# Altium schematic sheet CAMERA_DVP_FPC24_OV7670.SchDoc
size A3; SheetNumber: 6; SheetTotal: 7
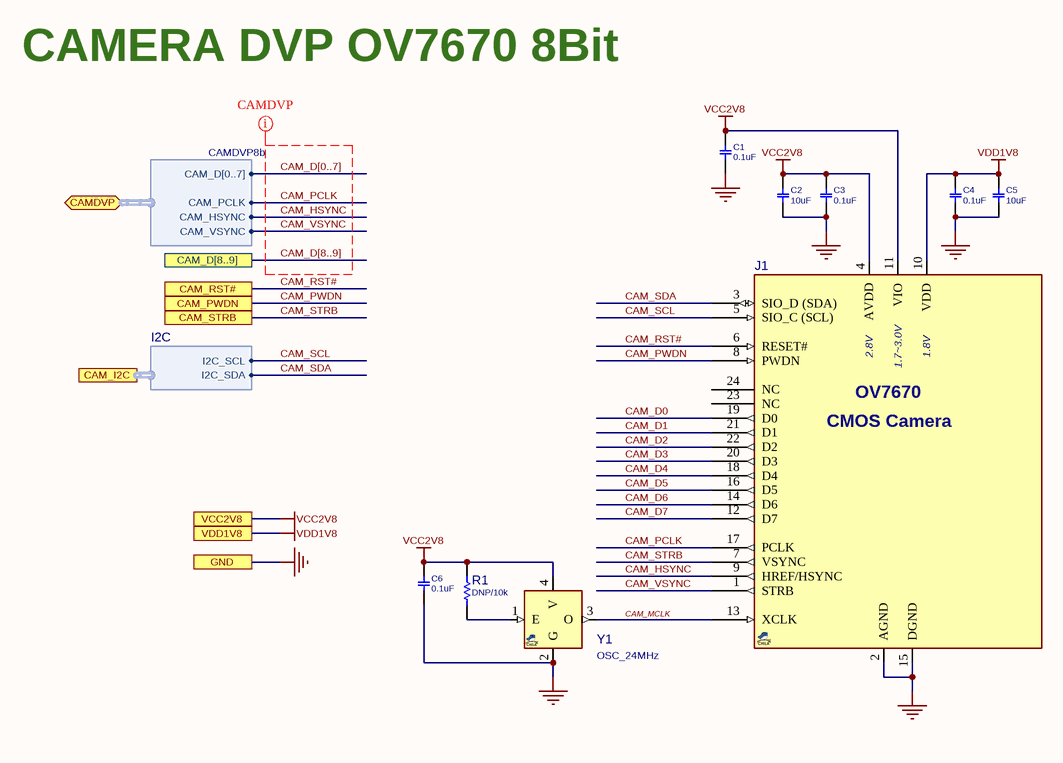
[diagram p0: CAMERA_DVP_FPC24_OV7670.SchDoc]

## Parts
C1  0.1uF  [C0402]
C2  10uF  [C0402]
C3  0.1uF  [C0402]
C4  0.1uF  [C0402]
C5  10uF  [C0402]
C6  0.1uF  [C0402]
J1  OV7670  [FPC50_24]  (value not drawn)
R1  DNP/10k  [R0402]
Y1  OSC_24MHz  [XTL_4_3225GEN]

## Ports
CAM_D[8..9], CAM_I2C (harness I2C), CAM_PWDN, CAM_RST#, CAM_STRB, CAMDVP (bidir, harness CAMDVP8b), GND, VCC2V8, VDD1V8

## Harnesses
CAMDVP8b: CAM_D[0..7], CAM_PCLK, CAM_HSYNC, CAM_VSYNC
I2C: I2C_SCL, I2C_SDA

## Nets
GND: C1.2 C2.2 C3.2 C4.2 C5.2 C6.2 J1.2(AGND) J1.15(DGND) Y1.2(G) ; port GND
VCC2V8: C1.1 C2.1 C3.1 C6.1 J1.4(AVDD) J1.11(VIO) R1.1 Y1.4(V) ; port VCC2V8
VDD1V8: C4.1 C5.1 J1.10(VDD) ; port VDD1V8
CAM_D0: J1.19(D0)
CAM_D1: J1.21(D1)
CAM_D2: J1.22(D2)
CAM_D3: J1.20(D3)
CAM_D4: J1.18(D4)
CAM_D5: J1.16(D5)
CAM_D6: J1.14(D6)
CAM_D7: J1.12(D7)
CAM_HSYNC: J1.9(HREF/HSYNC) ; port CAMDVP.CAM_HSYNC
CAM_MCLK: J1.13(XCLK) Y1.3(O)
CAM_PCLK: J1.17(PCLK) ; port CAMDVP.CAM_PCLK
CAM_PWDN: J1.8(PWDN) ; port CAM_PWDN
CAM_RST#: J1.6(RESET#) ; port CAM_RST#
CAM_SCL: J1.5(SIO_C_(SCL)) ; port CAM_I2C.I2C_SCL
CAM_SDA: J1.3(SIO_D_(SDA)) ; port CAM_I2C.I2C_SDA
CAM_STRB: J1.7(VSYNC) ; port CAM_STRB
CAM_VSYNC: J1.1(STRB) ; port CAMDVP.CAM_VSYNC
NetR1_2: R1.2 Y1.1(E)

Not connected (* = marked no-connect by the designer): J1 23(NC) 24(NC)

## Buses and harness runs
bus CAM_D[0..7]
bus CAM_D[8..9] = port CAM_D[8..9]

## Layout directives
net class CAMDVP: CAM_D[0..7], CAM_D[8..9], CAM_HSYNC, CAM_PCLK, CAM_VSYNC

## Notes on the sheet
- CAMERA DVP OV7670 8Bit
- (in symbol OV7670_FPC24) 2.8V; 1.7~3.0V; 1.8V; CMOS Camera

## Library data of the parts
C1-C6 = CAP_SMD_MLCC_100n50TDK: CAP, MLCC; PARAM2: 50V; PARAM: -; MANF_P#: -; MANF: -; ASSEMBLY: ASSEMBLY; PRICE: -
  C1 C3 C4 C6: VALUE: 0.1uF
  C2 C5: VALUE: 10uF
J1 = OV7670_FPC24: Camera Module, Color CMOS VGA (640 x 480)  DVP FPC24; PARAM2: 2.8v; Value: OV7670; MANF_P#: OV7670; PARAM: VGA (640 x 480)
R1 = RES_SMD_1K_0402YK: RESISTOR, SMD, THICK FILM, YAGEO; MANF_P#: RC0402FR-071KL; PARAM: 0.063W; DESC: DESCRIPTION; DIST#: MOUSER; PARAM2: 1%; MANF: Yageo; ASSEMBLY: ASSEMBLY; PRICE: 100= 0.3$; VALUE: DNP/10k
Y1 = OSC_4_25MHz_3225E: CLOCK OSCILLATOR, 25MHz, 10PPM, 3.2X2.5mm; MANF: ECS; PARAM: 10PPM, 15pF, -40~85oC; DESC: DESCRIPTION; DIST#: MOUSER; PARAM2: 1.8~3.3V; MANF_P#: OT322524MJBA4SL; ASSEMBLY: ASSEMBLY; PRICE: 1= 1.2$; Value: OSC_24MHz